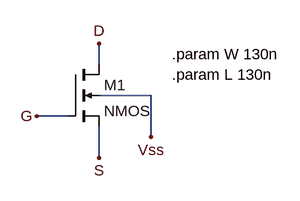
[diagram p0: schematic nmos.asc]
nmos.asc, the LTspice schematic file:
Version 4
SHEET 1 880 680
WIRE -80 -96 -80 -128
WIRE 0 -48 -80 -48
WIRE -128 -16 -176 -16
WIRE 0 16 0 -48
WIRE -80 48 -80 0
FLAG -176 -16 G
FLAG -80 48 S
FLAG -80 -128 D
FLAG 0 16 Vss
SYMBOL nmos4 -128 -96 R0
SYMATTR InstName M1
SYMATTR Value2 l={L} w={W}
TEXT 32 -112 Left 2 !.param W 130n
TEXT 32 -80 Left 2 !.param L 130n

The netlist it stands for:
* nmos.asc
M1 D G S Vss NMOS l={L} w={W}
.model NMOS NMOS
.model PMOS PMOS
.lib standard.mos
.param W 130n
.param L 130n
.backanno
.end